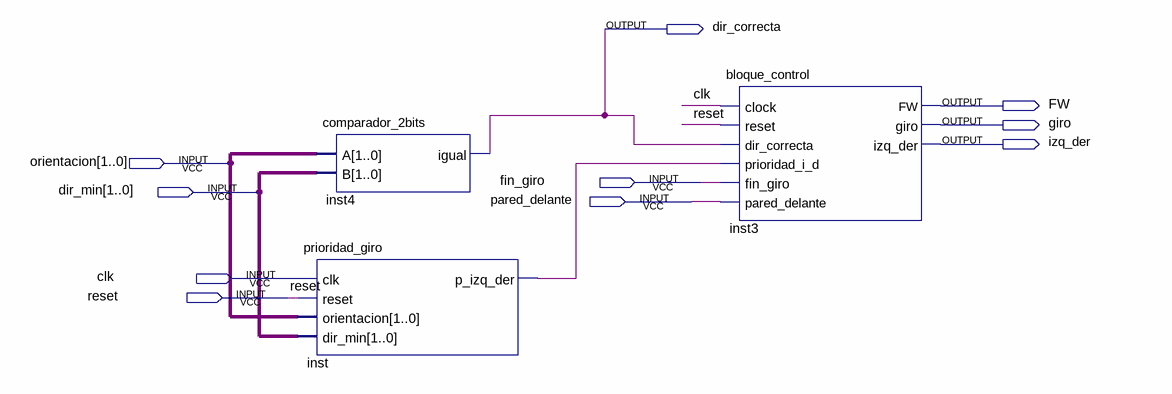
[diagram p0: schematic sheet]
// Quartus schematic Block5.bdf as structural Verilog: 3 symbols, 10 pins
module Block5 (
  input  [1:0] orientacion,
  input  fin_giro,
  input  [1:0] dir_min,
  input  pared_delante,
  input  clk,
  input  reset,
  output dir_correcta,
  output FW,
  output giro,
  output izq_der
);

  wire inst_p_izq_der;

  comparador_2bits inst4 (.A(orientacion), .B(dir_min), .igual(dir_correcta));
  prioridad_giro inst (
    .clk(clk), .reset(reset), .orientacion(orientacion), .dir_min(dir_min), .p_izq_der(inst_p_izq_der));
  bloque_control inst3 (
    .clock(clk), .reset(reset), .dir_correcta(dir_correcta), .prioridad_i_d(inst_p_izq_der),
    .fin_giro(fin_giro), .pared_delante(pared_delante), .FW(FW), .giro(giro), .izq_der(izq_der));
endmodule
